# Altium schematic sheet ppc_cpld.SchDoc: PowerPC CPLD/MMC
size A3; Date: DO NOT USE, RATHER USE PROJ OPTIONS; DrawnBy: DO NOT USE, RATHER USE PROJ OPTIONS; Engineer: DO NOT USE, RATHER USE PROJ OPTIONS; Organization: DO NOT USE, RATHER USE PROJ OPTIONS; DocumentNumber: DO NOT USE, RATHER USE PROJ OPTIONS; Revision: DO NOT USE, RATHER USE PROJ OPTIONS; SheetNumber: 10; SheetTotal: 29; SCH_Sheet_Filename: ppc_cpld.SchDoc; CurrentTime: DO NOT USE, RATHER USE PROJ OPTIONS; Time: DO NOT USE, RATHER USE PROJ OPTIONS; DocumentFullPathAndName: DO NOT USE, RATHER USE PROJ OPTIONS; DocumentName: DO NOT USE, RATHER USE PROJ OPTIONS; ModifiedDate: DO NOT USE, RATHER USE PROJ OPTIONS; ImagePath: DO NOT USE, RATHER USE PROJ OPTIONS
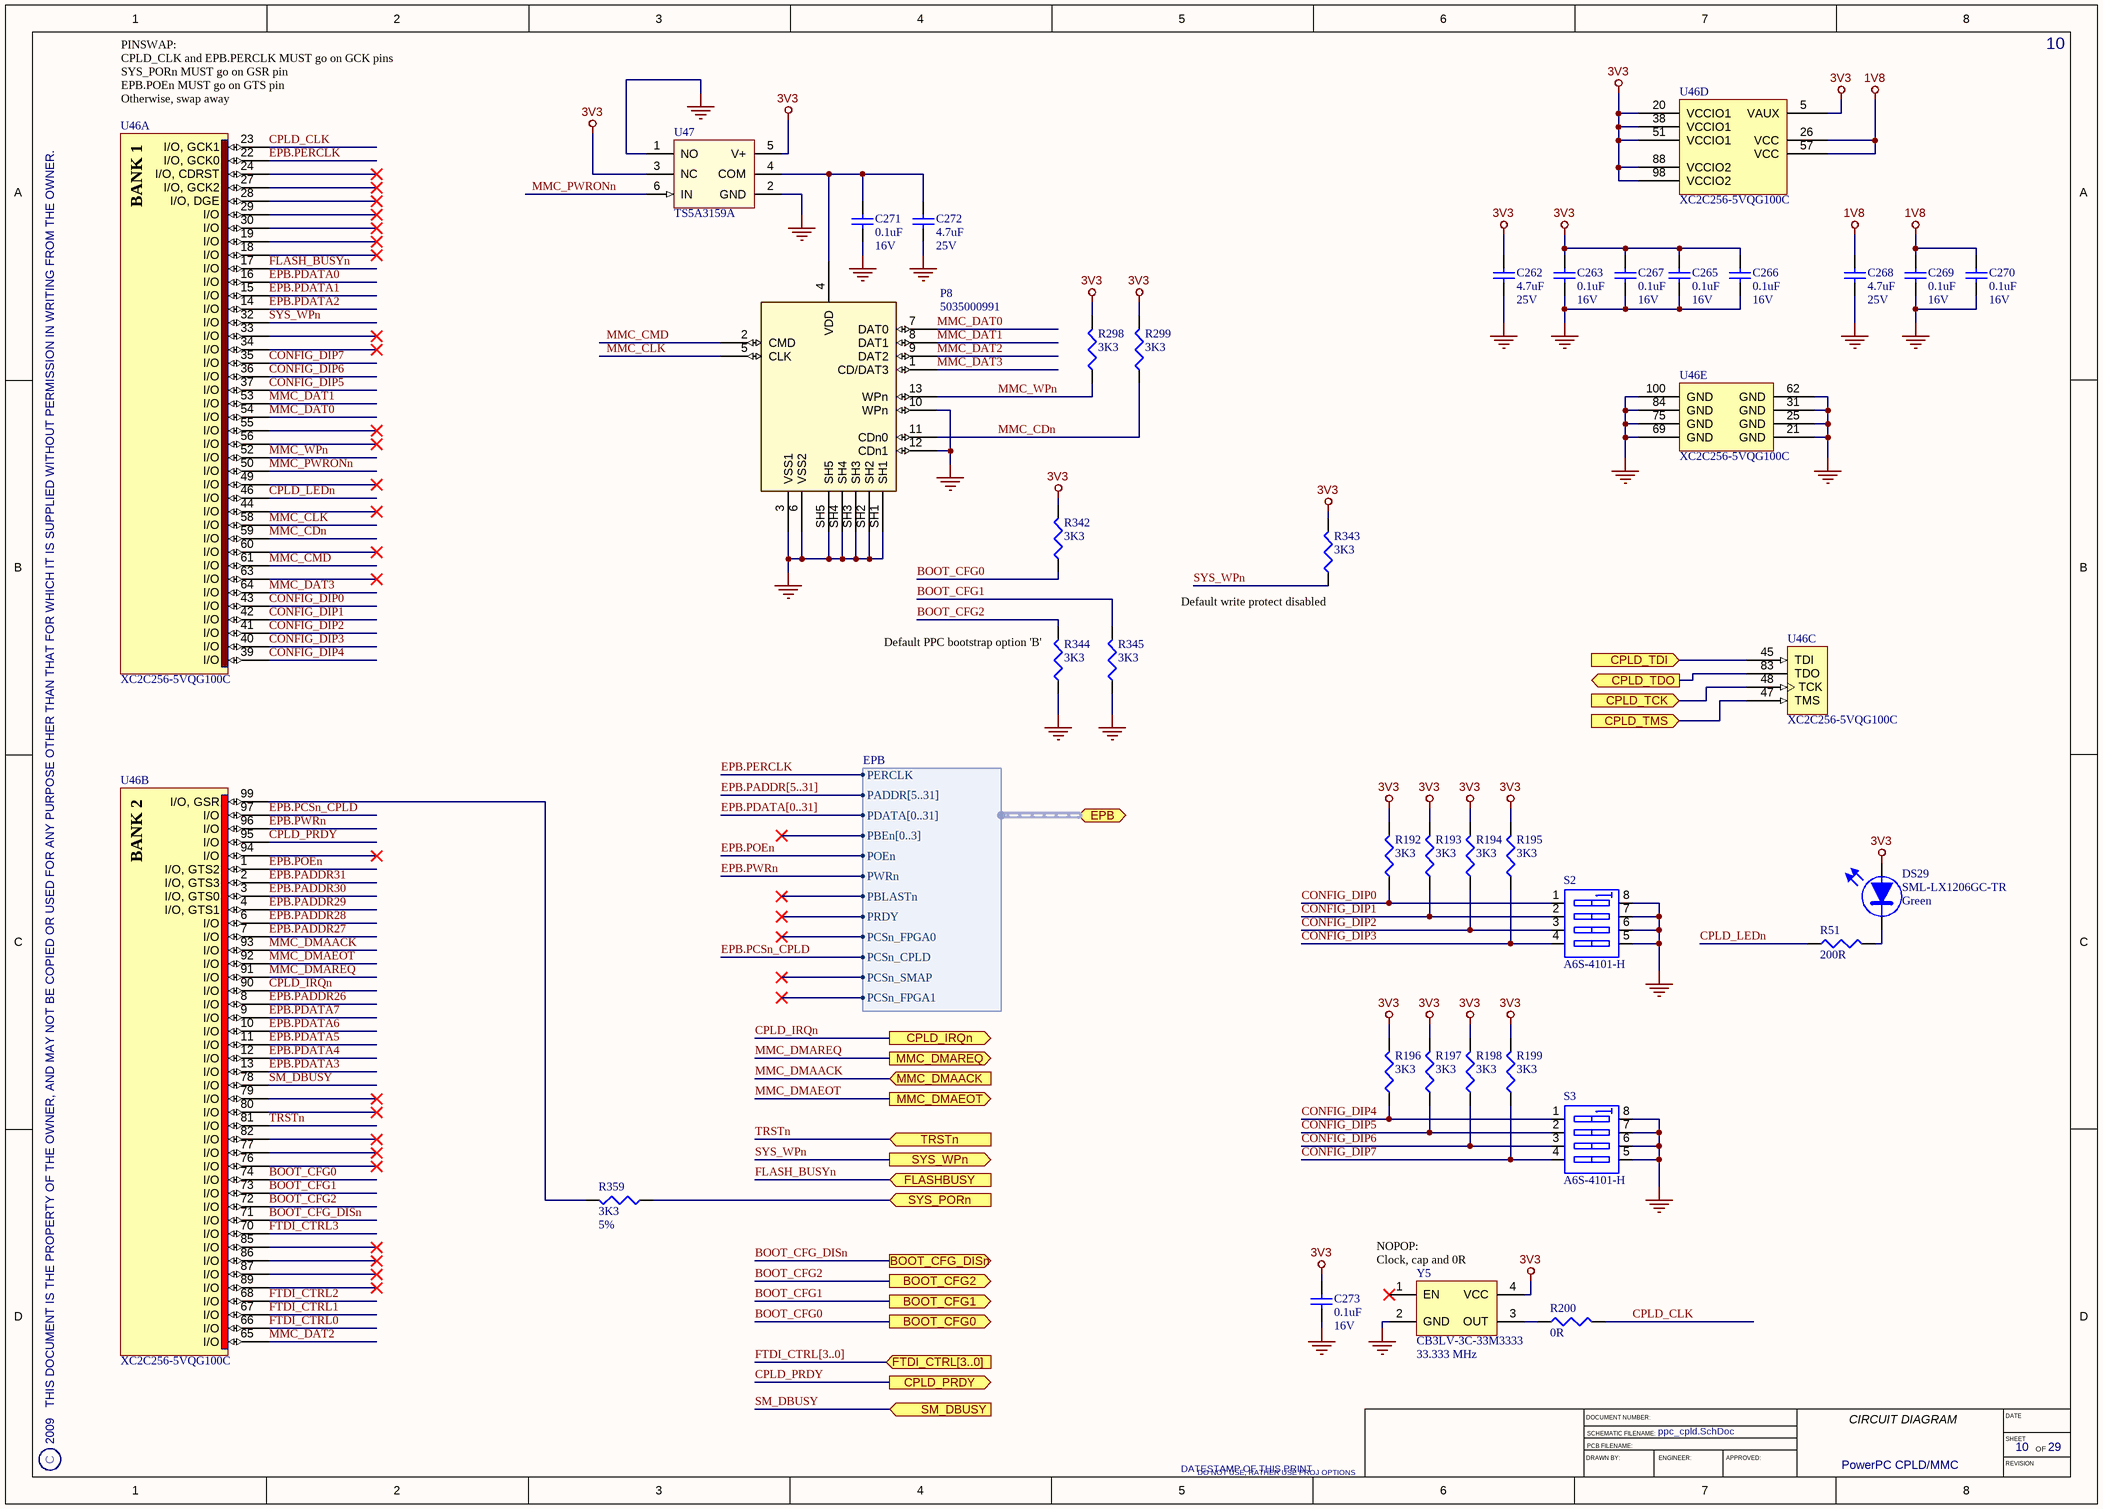
[diagram p0: ppc_cpld.SchDoc]

## Parts
C262  Rating: 25V  [CAPC2012X127L]  (hidden comment: 4.7uF)
C263  Rating: 16V  [CAPC1005X60L]  (hidden comment: 0.1uF)
C265  Rating: 16V  [CAPC1005X60L]  (hidden comment: 0.1uF)
C266  Rating: 16V  [CAPC1005X60L]  (hidden comment: 0.1uF)
C267  Rating: 16V  [CAPC1005X60L]  (hidden comment: 0.1uF)
C268  Rating: 25V  [CAPC2012X127L]  (hidden comment: 4.7uF)
C269  Rating: 16V  [CAPC1005X60L]  (hidden comment: 0.1uF)
C270  Rating: 16V  [CAPC1005X60L]  (hidden comment: 0.1uF)
C271  Rating: 16V  [CAPC1005X60L]  (hidden comment: 0.1uF)
C272  Rating: 25V  [CAPC2012X127L]  (hidden comment: 4.7uF)
C273  Rating: 16V  [CAPC1005X60L]  (hidden comment: 0.1uF)
DS29  SML-LX1206GC-TR  Colour: Green  [LEDC3216X120N]
P8  5035000991  [MOLEX_5035000991]
R51  200R  [RESC1005X40L]
R192  3K3  [RESC1005X40L]
R193  3K3  [RESC1005X40L]
R194  3K3  [RESC1005X40L]
R195  3K3  [RESC1005X40L]
R196  3K3  [RESC1005X40L]
R197  3K3  [RESC1005X40L]
R198  3K3  [RESC1005X40L]
R199  3K3  [RESC1005X40L]
R200  0R  [RESC1005X40L]
R298  3K3  [RESC1005X40L]
R299  3K3  [RESC1005X40L]
R342  3K3  [RESC1005X40L]
R343  3K3  [RESC1005X40L]
R344  3K3  [RESC1005X40L]
R345  3K3  [RESC1005X40L]
R359  Tolerance: 5%  [RESC1005X40L]  (hidden comment: 3K3)
S2  A6S-4101-H  [A6S-4101-H]
S3  A6S-4101-H  [A6S-4101-H]
U46  XC2C256-5VQG100C  [VQG100_L]  (parts A,B,C,D,E of 5)
U47  TS5A3159A  [SOT23-6]
Y5  Frequency: 33.333 MHz  [CB3X-X-XMX]  (hidden comment: CB3LV-3C-33M3333)

## Ports
BOOT_CFG0 (out), BOOT_CFG1 (out), BOOT_CFG2 (out), BOOT_CFG_DISn (out), CPLD_IRQn (out), CPLD_PRDY (out), CPLD_TCK (in), CPLD_TDI (in), CPLD_TDO (out), CPLD_TMS (in), EPB (harness EPB), FLASHBUSY (in), FTDI_CTRL[3..0] (in), MMC_DMAACK (in), MMC_DMAEOT (out), MMC_DMAREQ (out), SM_DBUSY (in), SYS_PORn (in), SYS_WPn (out), TRSTn (in)

## Harnesses
EPB: PERCLK, PADDR[5..31], PDATA[0..31], PBEn[0..3], POEn, PWRn, PBLASTn, PRDY, PCSn_FPGA0, PCSn_CPLD, PCSn_SMAP, PCSn_FPGA1

## Nets
1V8: C268.2 C269.2 C270.2 U46.26(VCC) U46.57(VCC)
3V3: C262.2 C263.2 C265.2 C266.2 C267.2 C273.2 DS29.2(A) R192.2 R193.2 R194.2 R195.2 R196.2 R197.2 R198.2 R199.2 R298.2 R299.2 R342.2 R343.2 U46.5(VAUX) U46.20(VCCIO1) U46.38(VCCIO1) U46.51(VCCIO1) U46.88(VCCIO2) U46.98(VCCIO2) U47.3(NC) U47.5(V+) Y5.4(VCC)
GND: C262.1 C263.1 C265.1 C266.1 C267.1 C268.1 C269.1 C270.1 C271.1 C272.1 C273.1 P8.3(VSS1) P8.6(VSS2) P8.10(WPn) P8.12(CDn1) P8.SH1 P8.SH2 P8.SH3 P8.SH4 P8.SH5 R344.1 R345.1 S2.5(SW4B) S2.6(SW3B) S2.7(SW2B) S2.8(SW1B) S3.5(SW4B) S3.6(SW3B) S3.7(SW2B) S3.8(SW1B) U46.21(GND) U46.25(GND) U46.31(GND) U46.62(GND) U46.69(GND) U46.75(GND) U46.84(GND) U46.100(GND) U47.1(NO) U47.2(GND) Y5.2(GND)
BOOT_CFG0: R342.1 U46.74(I/O) ; port BOOT_CFG0
BOOT_CFG1: R345.2 U46.73(I/O) ; port BOOT_CFG1
BOOT_CFG2: R344.2 U46.72(I/O) ; port BOOT_CFG2
BOOT_CFG_DISn: U46.71(I/O) ; port BOOT_CFG_DISn
CONFIG_DIP0: R192.1 S2.1(SW1A) U46.43(I/O)
CONFIG_DIP1: R193.1 S2.2(SW2A) U46.42(I/O)
CONFIG_DIP2: R194.1 S2.3(SW3A) U46.41(I/O)
CONFIG_DIP3: R195.1 S2.4(SW4A) U46.40(I/O)
CONFIG_DIP4: R196.1 S3.1(SW1A) U46.39(I/O)
CONFIG_DIP5: R197.1 S3.2(SW2A) U46.37(I/O)
CONFIG_DIP6: R198.1 S3.3(SW3A) U46.36(I/O)
CONFIG_DIP7: R199.1 S3.4(SW4A) U46.35(I/O)
CPLD_CLK: R200.2 U46.23(I/O,_GCK1)
CPLD_IRQn: U46.90(I/O) ; port CPLD_IRQn
CPLD_LEDn: R51.1 U46.46(I/O)
CPLD_PRDY: U46.95(I/O) ; port CPLD_PRDY
CPLD_TCK: U46.48(TCK) ; port CPLD_TCK
CPLD_TDI: U46.45(TDI) ; port CPLD_TDI
CPLD_TDO: U46.83(TDO) ; port CPLD_TDO
CPLD_TMS: U46.47(TMS) ; port CPLD_TMS
EPB.PADDR26: U46.8(I/O)
EPB.PADDR27: U46.7(I/O)
EPB.PADDR28: U46.6(I/O)
EPB.PADDR29: U46.4(I/O,_GTS1)
EPB.PADDR30: U46.3(I/O,_GTS0)
EPB.PADDR31: U46.2(I/O,_GTS3)
EPB.PCSn_CPLD: U46.97(I/O) ; port EPB.PCSn_CPLD
EPB.PDATA0: U46.16(I/O)
EPB.PDATA1: U46.15(I/O)
EPB.PDATA2: U46.14(I/O)
EPB.PDATA3: U46.13(I/O)
EPB.PDATA4: U46.12(I/O)
EPB.PDATA5: U46.11(I/O)
EPB.PDATA6: U46.10(I/O)
EPB.PDATA7: U46.9(I/O)
EPB.PERCLK: U46.22(I/O,_GCK0) ; port EPB.PERCLK
EPB.POEn: U46.1(I/O,_GTS2) ; port EPB.POEn
EPB.PWRn: U46.96(I/O) ; port EPB.PWRn
FLASH_BUSYn: U46.17(I/O) ; port FLASHBUSY
FTDI_CTRL0: U46.66(I/O)
FTDI_CTRL1: U46.67(I/O)
FTDI_CTRL2: U46.68(I/O)
FTDI_CTRL3: U46.70(I/O)
MMC_CDn: P8.11(CDn0) R299.1 U46.59(I/O)
MMC_CLK: P8.5(CLK) U46.58(I/O)
MMC_CMD: P8.2(CMD) U46.61(I/O)
MMC_DAT0: P8.7(DAT0) U46.54(I/O)
MMC_DAT1: P8.8(DAT1) U46.53(I/O)
MMC_DAT2: P8.9(DAT2) U46.65(I/O)
MMC_DAT3: P8.1(CD/DAT3) U46.64(I/O)
MMC_DMAACK: U46.93(I/O) ; port MMC_DMAACK
MMC_DMAEOT: U46.92(I/O) ; port MMC_DMAEOT
MMC_DMAREQ: U46.91(I/O) ; port MMC_DMAREQ
MMC_PWRONn: U46.50(I/O) U47.6(IN)
MMC_WPn: P8.13(WPn) R298.1 U46.52(I/O)
SM_DBUSY: U46.78(I/O) ; port SM_DBUSY
SYS_PORn: R359.1 ; port SYS_PORn
SYS_WPn: R343.1 U46.32(I/O) ; port SYS_WPn
TRSTn: U46.81(I/O) ; port TRSTn
NetC271_2: C271.2 C272.2 P8.4(VDD) U47.4(COM)
NetDS29_1: DS29.1(K) R51.2
NetR200_1: R200.1 Y5.3(OUT)
NetR359_2: R359.2 U46.99(I/O,_GSR)

Not connected (* = marked no-connect by the designer): U46 18(I/O)* 19(I/O)* 24(I/O,_CDRST)* 27(I/O,_GCK2)* 28(I/O,_DGE)* 29(I/O)* 30(I/O)* 33(I/O)* 34(I/O)* 44(I/O)* 49(I/O)* 55(I/O)* 56(I/O)* 60(I/O)* 63(I/O)* 76(I/O)* 77(I/O)* 79(I/O)* 80(I/O)* 82(I/O)* 85(I/O)* 86(I/O)* 87(I/O)* 89(I/O)* 94(I/O)*; Y5 1(EN)*

## Buses and harness runs
bus EPB.PADDR[5..31]
bus EPB.PDATA[0..31]
bus FTDI_CTRL[3..0] = port FTDI_CTRL[3..0]

## Notes on the sheet
- (near U46) PINSWAP:
  CPLD_CLK and EPB.PERCLK MUST go on GCK pins
  SYS_PORn MUST go on GSR pin
  EPB.POEn MUST go on GTS pin
  Otherwise, swap away
- (near R344) Default PPC bootstrap option 'B'
- (near R343) Default write protect disabled
- (near Y5) NOPOP:
  Clock, cap and 0R
- 2009   THIS DOCUMENT IS THE PROPERTY OF THE OWNER, AND MAY NOT BE COPIED OR USED FOR ANY PURPOSE OTHER THAN THAT FOR WHICH IT IS SUPPLIED WITHOUT PERMISSION IN WRITING FROM THE OWNER.
- C
- DATESTAMP OF THIS PRINT
- DRAWN BY:
- DOCUMENT NUMBER:
- SCHEMATIC FILENAME:
- PCB FILENAME:
- ENGINEER:
- APPROVED:
- CIRCUIT DIAGRAM
- DATE
- SHEET
- REVISION
- OF
- (in symbol IC-PLD-1, part A) BANK 1
- (in symbol IC-PLD-1, part B) BANK 2

## Library data of the parts
C262 C268 C272 = CAP-CER-3: 4.7uF, Ceramic Capacitor; Manufacturer: MURATA; PartNum: GRM21BR61E475KA12K; Tolerance: 10%; Dielectric: X5R; POD number: CAP-CER-3; Value: 4.7uF; RoHS: Y; Sort Value: 4.7; Category: Capacitors; Subcategory: Ceramic
C263 C265-C267 C269-C271 C273 = CAP-CER-1: 0.1uF, Ceramic Capacitor; Manufacturer: VENKEL; PartNum: C0402X7R160-104KN; Tolerance: 10%; Dielectric: X7R; POD number: CAP-CER-1; Value: 0.1uF; RoHS: Y; Sort Value: 0.1; Category: Capacitors; Subcategory: Ceramic
DS29 = OPTO-LED-0: Green, Surface mount, LED, 1206; Manufacturer: LUMEX; Vdrop: 2.2V; Rating: 20mA; POD number: OPTO-LED-0; PartNum: SML-LX1206GC-TR; RoHS: Y; Category: OPTO; Subcategory: LED
P8 = CONN-PCB-24: Push/Push SD Card Connector with Card Detection; Manufacturer: Molex; POD number: CONN-PCB-24; PartNum: 5035000991; RoHS: Y; Category: CONN; Subcategory: PCB
R51 = RES-TF-19: 200R, 1.1mm x 0.5mm, Thick Film Resistor; Manufacturer: ROYALOHM; PartNum: 0402WGF0201T1E; Tolerance: 1%; Rating: 0.0625W; POD number: RES-TF-19; Value: 200R; Sort Value: 200; Category: Resistors; Subcategory: ThickFilm; HelpURL: *.pdf
R192-R199 R298 R299 R342-R345 = RES-TF-7: 3K3, 1.1mm x 0.5mm, Thick Film Resistor; Manufacturer: ROYALOHM; PartNum: 0402WGJ0332T1E; Tolerance: 5%; Rating: 0.0625W; POD number: RES-TF-7; Value: 3K3; Sort Value: 3300; Category: Resistors; Subcategory: ThickFilm; HelpURL: *.pdf
R200 = RES-TF-0: 0R, 1.1mm x 0.5mm, Thick Film Resistor; Manufacturer: ROYALOHM; PartNum: 0402WG00000T1E; Tolerance: 0%; Rating: 0.0625W; POD number: RES-TF-0; Value: 0R; Sort Value: 0; Category: Resistors; Subcategory: ThickFilm; HelpURL: *.pdf
R359 = RES-TF-7: 3K3, 1.1mm x 0.5mm, Thick Film Resistor; Manufacturer: ROYALOHM; PartNum: 0402WGJ0332T1E; Rating: 0.0625W; POD number: RES-TF-7; RoHS: Y; Value: 3K3; Sort Value: 3300; Category: Resistors; Subcategory: ThickFilm; HelpURL: http://www.royalohm.com/pdf/general.pdf
S2 S3 = ELMECH-SW-0: 4-Input, Surface mount, DIP Switch; Manufacturer: OMRON; POD number: ELMECH-SW-0; PartNum: A6S-4101-H; RoHS: Y; Category: ELMECH; Subcategory: Switches
U46 = IC-PLD-1: CoolRunner-II, 1.8V, 256 Macrocell CPLD, 100-Pin VQFP, Pb-Free, Commercial Grade; Manufacturer: Xilinx; POD number: IC-PLD-1; PartNum: XC2C256-5VQG100C; RoHS: Y; Category: IC; Subcategory: PLD
U47 = IC-LOG-6: 6-pin 1 Ohm analogue switch; Manufacturer: Texas Instruments; POD number: IC-LOG-6; PartNum: TS5A3159A; RoHS: Y; Category: IC; Subcategory: Logic
Y5 = RESN-CLK-1: Surface mount, 33.3333 MHz, 3V3 Clock, oscillator; Manufacturer: CTS; POD number: RESN-CLK-1; PartNum: CB3LV-3C-33M3333; RoHS: Y; Category: RESN; Subcategory: Clock Oscillators